# EAGLE design mainboard (EAGLE 9.6.2)
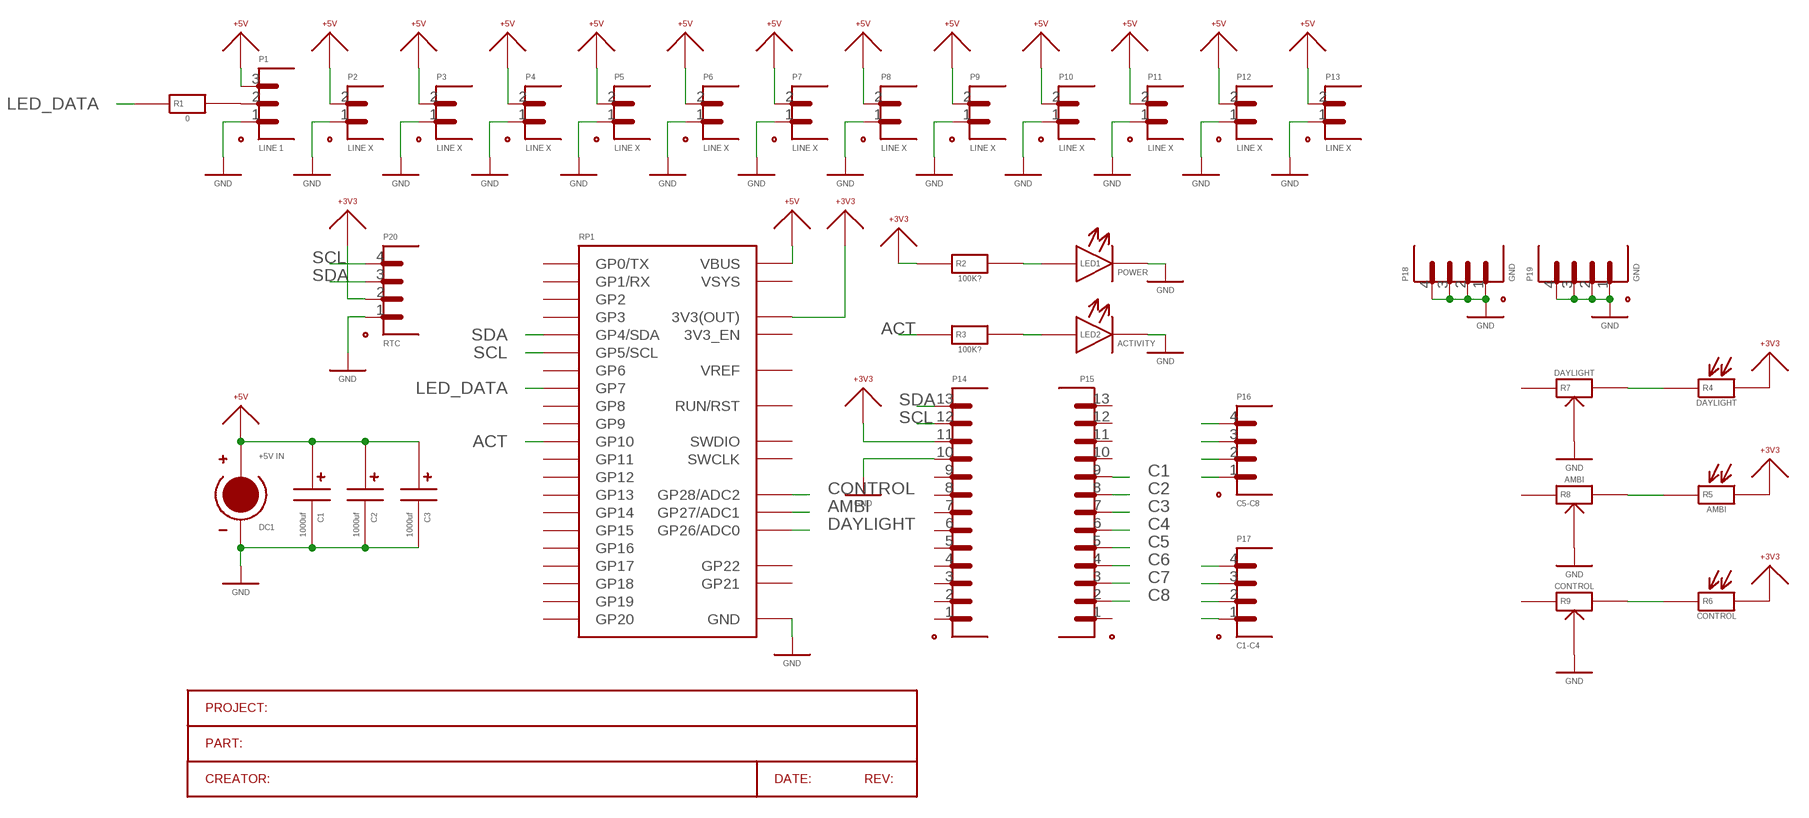
[diagram p0: schematic, sheet 1]

## Parts
C1  1000uf  CAPACITOR_POLARISED_8MM  [CAPACITOR_POLAR_8MM]
C2  1000uf  CAPACITOR_POLARISED_8MM  [CAPACITOR_POLAR_8MM]
C3  1000uf  CAPACITOR_POLARISED_8MM  [CAPACITOR_POLAR_8MM]
DC1  +5V IN  DC-POWER_SCREW-TERMINAL  [SCREW-TERMINAL_2-WAY]
LED1  POWER  LED_3MM  [LED_3MM]
LED2  ACTIVITY  LED_3MM  [LED_3MM]
P1  LINE 1  PORT_3-PIN_SCREW-TERMINAL  [SCREW-TERMINAL_3-WAY]
P2  LINE X  PORT_2-PIN_SCREW-TERMINAL  [SCREW-TERMINAL_2-WAY]
P3  LINE X  PORT_2-PIN_SCREW-TERMINAL  [SCREW-TERMINAL_2-WAY]
P4  LINE X  PORT_2-PIN_SCREW-TERMINAL  [SCREW-TERMINAL_2-WAY]
P5  LINE X  PORT_2-PIN_SCREW-TERMINAL  [SCREW-TERMINAL_2-WAY]
P6  LINE X  PORT_2-PIN_SCREW-TERMINAL  [SCREW-TERMINAL_2-WAY]
P7  LINE X  PORT_2-PIN_SCREW-TERMINAL  [SCREW-TERMINAL_2-WAY]
P8  LINE X  PORT_2-PIN_SCREW-TERMINAL  [SCREW-TERMINAL_2-WAY]
P9  LINE X  PORT_2-PIN_SCREW-TERMINAL  [SCREW-TERMINAL_2-WAY]
P10  LINE X  PORT_2-PIN_SCREW-TERMINAL  [SCREW-TERMINAL_2-WAY]
P11  LINE X  PORT_2-PIN_SCREW-TERMINAL  [SCREW-TERMINAL_2-WAY]
P12  LINE X  PORT_2-PIN_SCREW-TERMINAL  [SCREW-TERMINAL_2-WAY]
P13  LINE X  PORT_2-PIN_SCREW-TERMINAL  [SCREW-TERMINAL_2-WAY]
P14  PORT_13-PIN_HEADER  [HEADER_13-PIN]
P15  PORT_13-PIN_HEADER  [HEADER_13-PIN]
P16  C5-C8  PORT_4-PIN_R5210  [R5210_4-PIN]
P17  C1-C4  PORT_4-PIN_R5210  [R5210_4-PIN]
P18  GND  PORT_4-PIN_R5210  [R5210_4-PIN]
P19  GND  PORT_4-PIN_R5210  [R5210_4-PIN]
P20  RTC  PORT_4-PIN_R5210  [R5210_4-PIN]
R1  0  RESISTOR_10.16MM  [RESISTOR_10.16MM]
R2  100K?  RESISTOR_10.16MM  [RESISTOR_10.16MM]
R3  100K?  RESISTOR_10.16MM  [RESISTOR_10.16MM]
R4  DAYLIGHT  RESISTOR_LRD_R5210  [R5210_2-PIN]
R5  AMBI  RESISTOR_LRD_2.54MM  [PASSIVE_2.54MM]
R6  CONTROL  RESISTOR_LRD_2.54MM  [PASSIVE_2.54MM]
R7  DAYLIGHT  RESISTOR_VARIABLE_TRIM-POT  [TRIM-POT_A]
R8  AMBI  RESISTOR_VARIABLE_TRIM-POT  [TRIM-POT_A]
R9  CONTROL  RESISTOR_VARIABLE_TRIM-POT  [TRIM-POT_A]
RP1  RASPBERRY-PI-PICO_W  [RASPBERRY-PI-PICO_W]

## Nets
+3V3: P14.11 P20.2 R2.X R4.2(Y) R5.Y R6.Y RP1.36(3V3(OUT))
+5V: C1.A C2.A C3.A DC1.2(+V) P1.3 P2.2 P3.2 P4.2 P5.2 P6.2 P7.2 P8.2 P9.2 P10.2 P11.2 P12.2 P13.2 RP1.40(VBUS)
ACT: R3.X RP1.14(GP10)
AMBI: R5.X R8.Y RP1.32(GP27/ADC1)
C1: P15.9 P17.1
C2: P15.8 P17.2
C3: P15.7 P17.3
C4: P15.6 P17.4
C5: P15.5 P16.1
C6: P15.4 P16.2
C7: P15.3 P16.3
C8: P15.2 P16.4
CONTROL: R6.X R9.Y RP1.34(GP28/ADC2)
DAYLIGHT: R4.1(X) R7.Y RP1.31(GP26/ADC0)
GND: C1.C C2.C C3.C DC1.1(-V) LED1.C LED2.C P1.1 P2.1 P3.1 P4.1 P5.1 P6.1 P7.1 P8.1 P9.1 P10.1 P11.1 P12.1 P13.1 P14.10 P18.1 P18.2 P18.3 P18.4 P19.1 P19.2 P19.3 P19.4 P20.1 R7.1 R8.1 R9.1 RP1.3(GND) RP1.8(GND) RP1.13(GND) RP1.18(GND) RP1.23(GND) RP1.28(GND) RP1.33(GND) RP1.38(GND) RP1.D_GND(GND)
LED_DATA: R1.X RP1.10(GP7)
N$1: P1.2 R1.Y
N$2: LED1.A R2.Y
N$3: LED2.A R3.Y
SCL: P14.12 P20.4 RP1.7(GP5/SCL)
SDA: P14.13 P20.3 RP1.6(GP4/SDA)
Unconnected: P14.1 P14.2 P14.3 P14.4 P14.5 P14.6 P14.7 P14.8 P14.9 P15.1 P15.10 P15.11 P15.12 P15.13 R7.X R8.X R9.X RP1.1(GP0/TX) RP1.2(GP1/RX) RP1.4(GP2) RP1.5(GP3) RP1.9(GP6) RP1.11(GP8) RP1.12(GP9) RP1.15(GP11) RP1.16(GP12) RP1.17(GP13) RP1.19(GP14) RP1.20(GP15) RP1.21(GP16) RP1.22(GP17) RP1.24(GP18) RP1.25(GP19) RP1.26(GP20) RP1.27(GP21) RP1.29(GP22) RP1.30(RUN/RST) RP1.35(VREF) RP1.37(3V3_EN) RP1.SWCLK RP1.SWDIO

## Power pins joined to a net without a drawn wire
VSYS: RP1.39(VSYS)

## Library data of the parts
C1-C3 = myLibrary:CAPACITOR_POLARISED
DC1 = myLibrary:DC-POWER
LED1 LED2 = myLibrary:LED
P1 = myLibrary:PORT_3-PIN
P2-P13 = myLibrary:PORT_2-PIN
P14 P15 = myLibrary:PORT_13-PIN
P16-P20 = myLibrary:PORT_4-PIN
R1-R3 = myLibrary:RESISTOR
R4-R6 = myLibrary:RESISTOR_LRD
R7-R9 = myLibrary:RESISTOR_VARIABLE
RP1 = myLibrary:RASPBERRY-PI-PICO

## Board
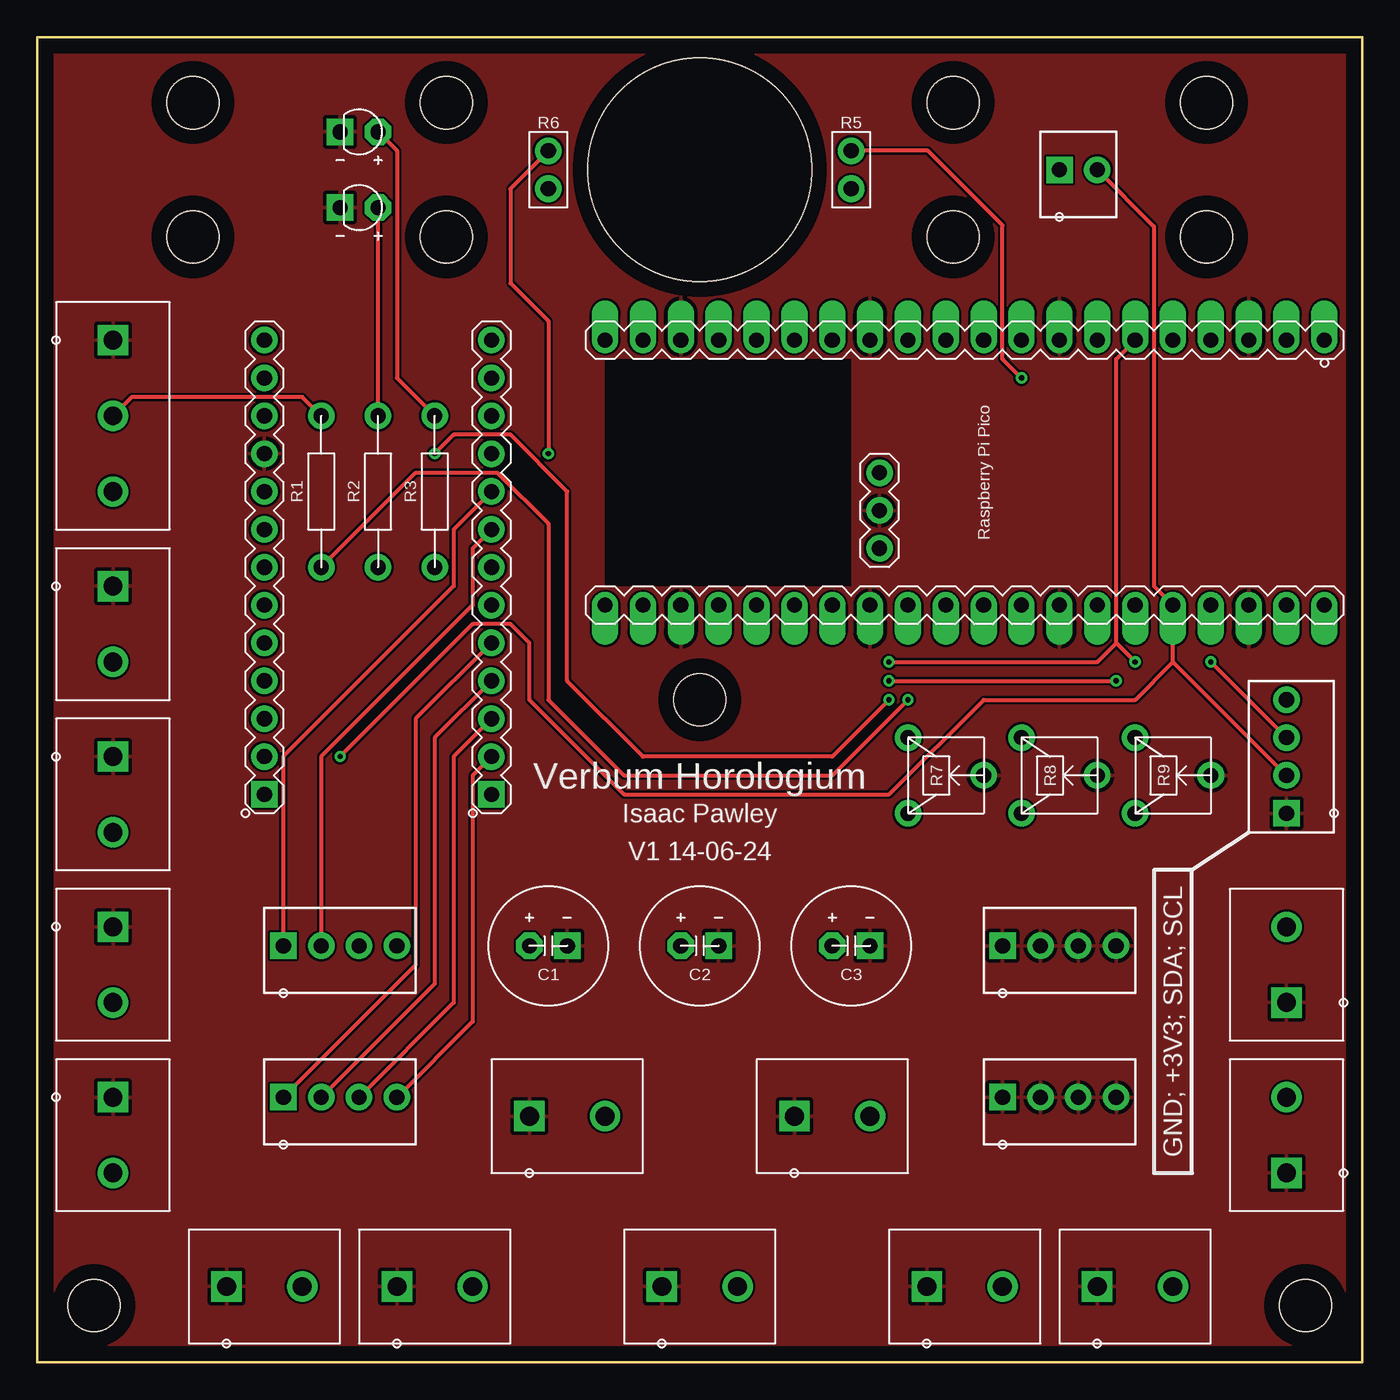
[diagram p1: board, top side]
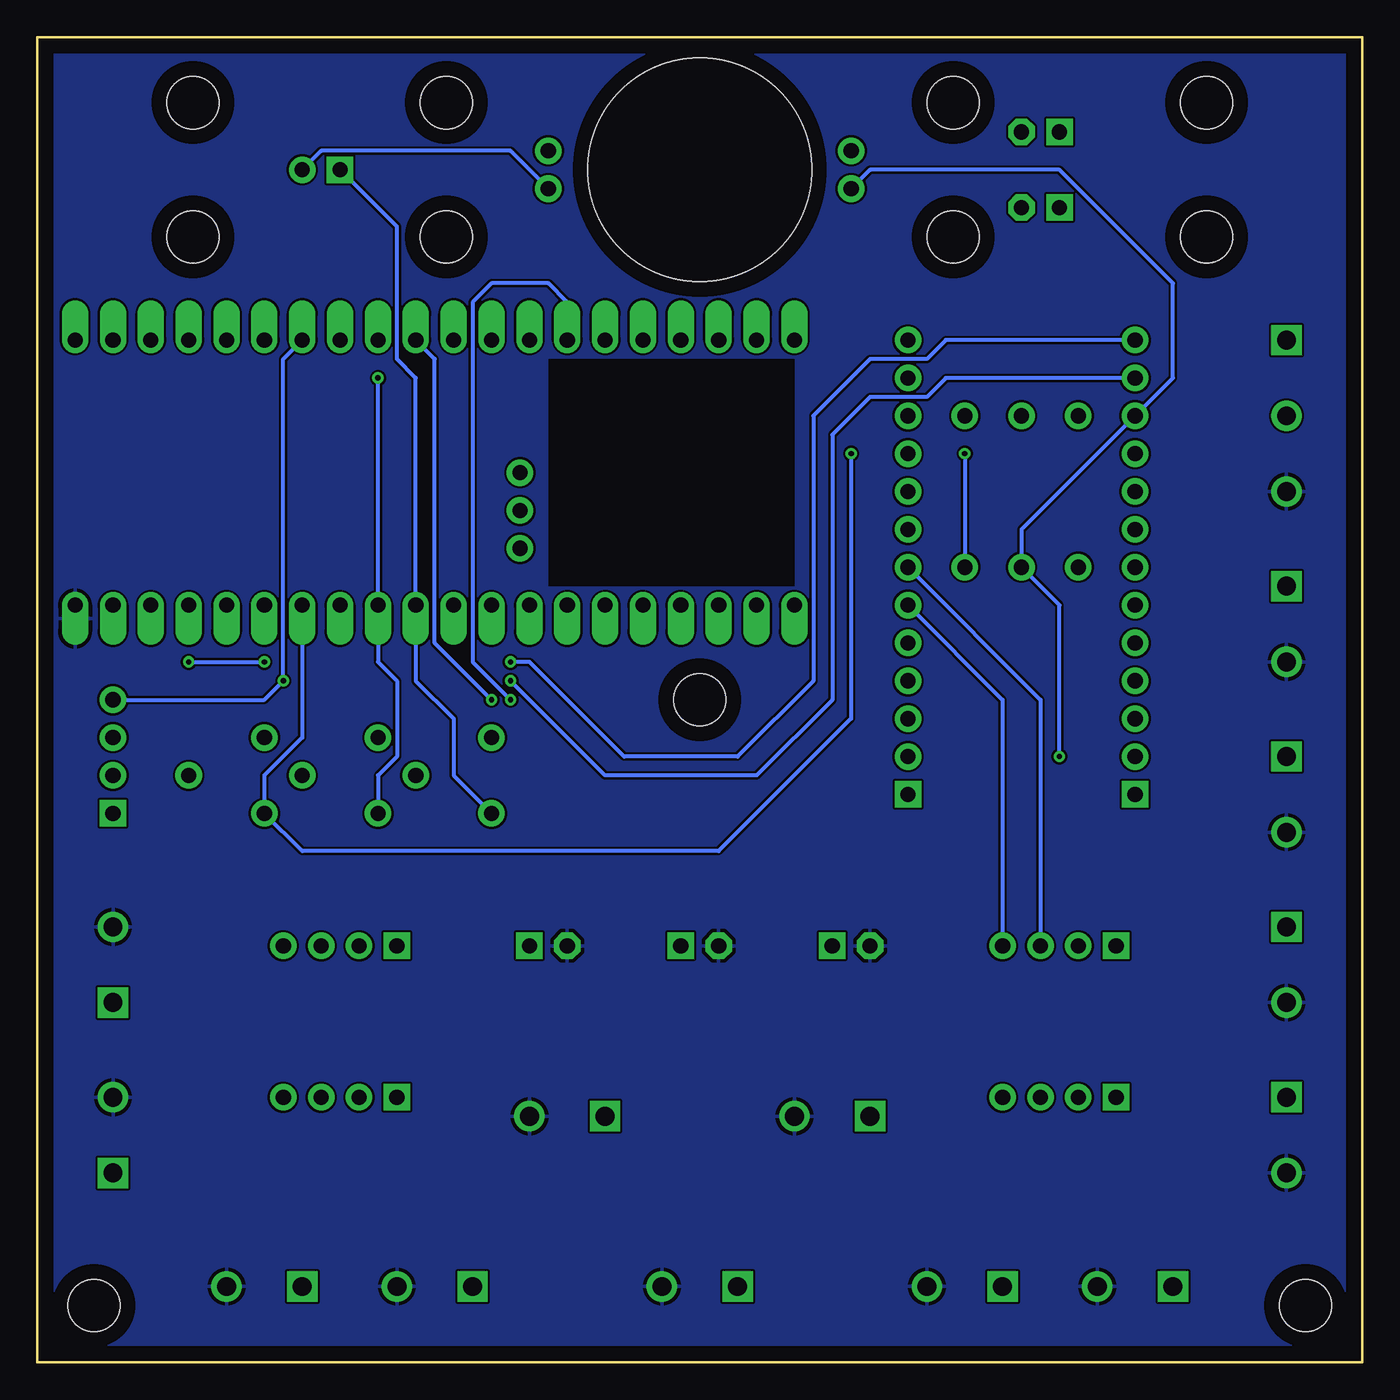
[diagram p2: board, bottom side, seen from below]

Size 88.9 x 88.9 mm. Coordinates in mm from the lower left corner, seen from the top.
Outline: 0,0 88.9,0 88.9,88.9 0,88.9 0,0
Copper layers (1*16): Top 0.035mm / dielectric 1.5mm / Bottom 0.035mm
Design rules "default": minimum track width 6mil, minimum drill 0.35mm, track to track 6mil, track to pad 6mil, pad to pad 6mil, via to via 6mil, smd to smd 6mil, copper to edge 40mil, drill to drill 6mil, minimum pad ring 10mil, minimum via ring 8mil, stop-mask expansion 4mil, vias tented up to drill 0mil, thermal gap 10mil
Holes 3.5 mm at 61.45,84.51 61.45,75.51 78.45,84.51 78.45,75.51 10.45,84.51 10.45,75.51 27.45,84.51 27.45,75.51 3.81,3.81 85.09,3.81 44.45,44.45
Holes 15 mm at 44.45,80.01

### Footprints (pad centres in the part's own frame; a part is rotated, then mirrored left to right if it is on the bottom)
CAPACITOR_POLAR_8MM = drill 1.016 pad 1.778 octagon: A -1.27,0 | drill 1.016 pad 1.778 square: C 1.27,0
SCREW-TERMINAL_2-WAY = drill 1.27 pad 2.032 square: 1 -2.54,0 | drill 1.27 pad 2.032: 2 2.54,0
LED_3MM = drill 1.016 pad 1.778 octagon: A -1.27,0 | drill 1.016 pad 1.778 square: C 1.27,0
SCREW-TERMINAL_3-WAY = drill 1.27 pad 2.032 square: 1 -5.08,0 | drill 1.27 pad 2.032: 2 0,0; 3 5.08,0
HEADER_13-PIN = drill 1.016 pad 1.778 square: 1 0,0 | drill 1.016 pad 1.778: 2 0,2.54; 3 0,5.08; 4 0,7.62; 5 0,10.16; 6 0,12.7; 7 0,15.24; 8 0,17.78; 9 0,20.32; 10 0,22.86; 11 0,25.4; 12 0,27.94; 13 0,30.48
R5210_4-PIN = drill 1.016 pad 1.778 square: 1 -3.81,0 | drill 1.016 pad 1.778: 2 -1.27,0; 3 1.27,0; 4 3.81,0
RESISTOR_10.16MM = drill 1.016 pad 1.778: X -5.08,0; Y 5.08,0
R5210_2-PIN = drill 1.016 pad 1.778 square: 1 -1.27,0 | drill 1.016 pad 1.778: 2 1.27,0
PASSIVE_2.54MM = drill 1.016 pad 1.778: X -1.27,0; Y 1.27,0
TRIM-POT_A = drill 1.016 pad 1.778: 1 2.54,0; X -2.54,2.54; Y -2.54,-2.54
RASPBERRY-PI-PICO_W = drill 1.016 pad 1.778 offset: 1 -8.89,24.13; 2 -8.89,21.59; 3 -8.89,19.05; 4 -8.89,16.51; 5 -8.89,13.97; 6 -8.89,11.43; 7 -8.89,8.89; 8 -8.89,6.35; 9 -8.89,3.81; 10 -8.89,1.27; 11 -8.89,-1.27; 12 -8.89,-3.81; 13 -8.89,-6.35; 14 -8.89,-8.89; 15 -8.89,-11.43; 16 -8.89,-13.97; 17 -8.89,-16.51; 18 -8.89,-19.05; 19 -8.89,-21.59; 20 -8.89,-24.13; 21 8.89,-24.13; 22 8.89,-21.59; 23 8.89,-19.05; 24 8.89,-16.51; 25 8.89,-13.97; 26 8.89,-11.43; 27 8.89,-8.89; 28 8.89,-6.35; 29 8.89,-3.81; 30 8.89,-1.27; 31 8.89,1.27; 32 8.89,3.81; 33 8.89,6.35; 34 8.89,8.89; 35 8.89,11.43; 36 8.89,13.97; 37 8.89,16.51; 38 8.89,19.05; 39 8.89,21.59; 40 8.89,24.13 | drill 1.016 pad 1.778: D_GND 2.54,-5.715; SWCLK 0,-5.715; SWDIO 5.08,-5.715

### Placement (x,y rotation side)
C1  34.29,27.94 0 top
C2  44.45,27.94 0 top
C3  54.61,27.94 0 top
DC1  44.45,5.08 0 top
LED1  21.59,77.47 180 top
LED2  21.59,82.55 180 top
P1  5.08,63.5 270 top
P2  5.08,49.53 270 top
P3  5.08,38.1 270 top
P4  5.08,26.67 270 top
P5  5.08,15.24 270 top
P6  83.82,26.67 90 top
P7  15.24,5.08 0 top
P8  53.34,16.51 0 top
P9  35.56,16.51 0 top
P10  83.82,15.24 90 top
P11  62.23,5.08 0 top
P12  73.66,5.08 0 top
P13  26.67,5.08 0 top
P14  15.24,38.1 0 top
P15  30.48,38.1 0 top
P16  20.32,17.78 0 top
P17  20.32,27.94 0 top
P18  68.58,27.94 0 top
P19  68.58,17.78 0 top
P20  83.82,40.64 90 top
R1  19.05,58.42 90 top
R2  22.86,58.42 90 top
R3  26.67,58.42 90 top
R4  69.85,80.01 0 top
R5  54.61,80.01 270 top
R6  34.29,80.01 270 top
R7  60.96,39.37 0 top
R8  68.58,39.37 0 top
R9  76.2,39.37 0 top
RP1  62.23,59.69 270 top

### Tracks (layer width: path | path; a pad name or v marks a point on that pad's centre or on a via)
+3V3  (via drill 0.35)
  Top 0.254: 76.2,46.99 RP1.36 74.93,52.07 74.93,76.2 R4.2 | v20.32,40.64 29.21,49.53 31.75,49.53 33.02,48.26 33.02,44.45 39.37,38.1 57.15,38.1 63.5,44.45 73.66,44.45 76.2,46.99 | P20.2 76.2,46.99
  Bottom 0.254: v20.32,40.64 20.32,50.8 R2.X 22.86,55.88 P14.11 12.7,66.04 12.7,72.39 20.32,80.01 33.02,80.01 R6.Y | R5.Y 57.15,81.28 69.85,81.28 R4.2
+5V
  pour Bottom: -2.54,91.44 -2.54,-2.54 91.44,-2.54 91.44,91.44
ACT  (via drill 0.35)
  Top 0.254: v57.15,44.45 53.34,40.64 40.64,40.64 35.56,45.72 35.56,58.42 31.75,62.23 27.94,62.23 v26.67,60.96
  Bottom 0.254: RP1.14 53.34,71.12 54.61,72.39 58.42,72.39 59.69,71.12 59.69,46.99 v57.15,44.45 | v26.67,60.96 R3.X
AMBI  (via drill 0.35)
  Top 0.254: v66.04,66.04 64.77,67.31 64.77,76.28 59.77,81.28 R5.X
  Bottom 0.254: R8.Y 66.04,39.37 64.77,40.64 64.77,45.72 66.04,46.99 RP1.32 v66.04,66.04
C1
  Top 0.254: P15.9 27.94,55.88 27.94,52.07 16.51,40.64 P17.1
C2
  Top 0.254: P15.8 29.21,54.61 29.21,50.8 19.05,40.64 P17.2
C3
  Bottom 0.254: P15.7 21.59,44.45 P17.3
C4
  Bottom 0.254: P17.4 24.13,44.45 P15.6
C5
  Top 0.254: P15.5 25.4,43.18 25.4,26.67 P16.1
C6
  Top 0.254: P15.4 26.67,41.91 26.67,25.4 P16.2
C7
  Top 0.254: P15.3 27.94,40.64 27.94,24.13 P16.3
C8
  Top 0.254: P15.2 29.21,39.37 29.21,22.86 P16.4
CONTROL  (via drill 0.35)
  Top 0.254: R6.X 31.75,78.74 31.75,72.39 34.29,69.85 v34.29,60.96
  Bottom 0.254: RP1.34 71.12,41.91 73.66,39.37 R9.Y 71.12,34.29 43.18,34.29 34.29,43.18 v34.29,60.96
DAYLIGHT
  Bottom 0.254: R7.Y 60.96,39.37 60.96,43.18 63.5,45.72 RP1.31 63.5,66.04 64.77,67.31 64.77,76.2 R4.1
GND
  pour Top: -1.27,90.17 -1.27,-1.27 90.17,-1.27 90.17,90.17
LED_DATA  (via drill 0.35)
  Top 0.254: R1.X 25.4,59.69 30.86,59.69 34.29,56.26 34.29,44.45 39.37,39.37 53.34,39.37 v58.42,44.45
  Bottom 0.254: v58.42,44.45 62.23,48.26 62.23,67.31 RP1.10
N$1
  Top 0.254: R1.Y 17.78,64.77 6.35,64.77 P1.2
N$2
  Top 0.254: R2.Y LED1.A
N$3
  Top 0.254: LED2.A 24.13,81.28 24.13,66.04 R3.Y
SCL  (via drill 0.35)
  Top 0.254: v57.15,45.72 v72.39,45.72
  Bottom 0.254: P14.12 27.94,66.04 29.21,64.77 33.02,64.77 35.56,62.23 35.56,44.45 40.64,39.37 50.8,39.37 v57.15,45.72 | RP1.7 72.39,67.31 v72.39,45.72 73.66,44.45 P20.4
SDA  (via drill 0.35)
  Top 0.254: v57.15,46.99 71.12,46.99 72.39,48.26 | RP1.6 72.39,67.31 72.39,48.26 | P20.3 v78.74,46.99 | v73.66,46.99 72.39,48.26
  Bottom 0.254: P14.13 27.94,68.58 29.21,67.31 33.02,67.31 36.83,63.5 36.83,45.72 41.91,40.64 49.53,40.64 55.88,46.99 v57.15,46.99 | v78.74,46.99 v73.66,46.99

### Text on the board
tPlace: Verbum Horologium | Isaac Pawley | V1 14-06-24 | GND; +3V3; SDA; SCL